# Altium project wifi-plug.PrjPcb
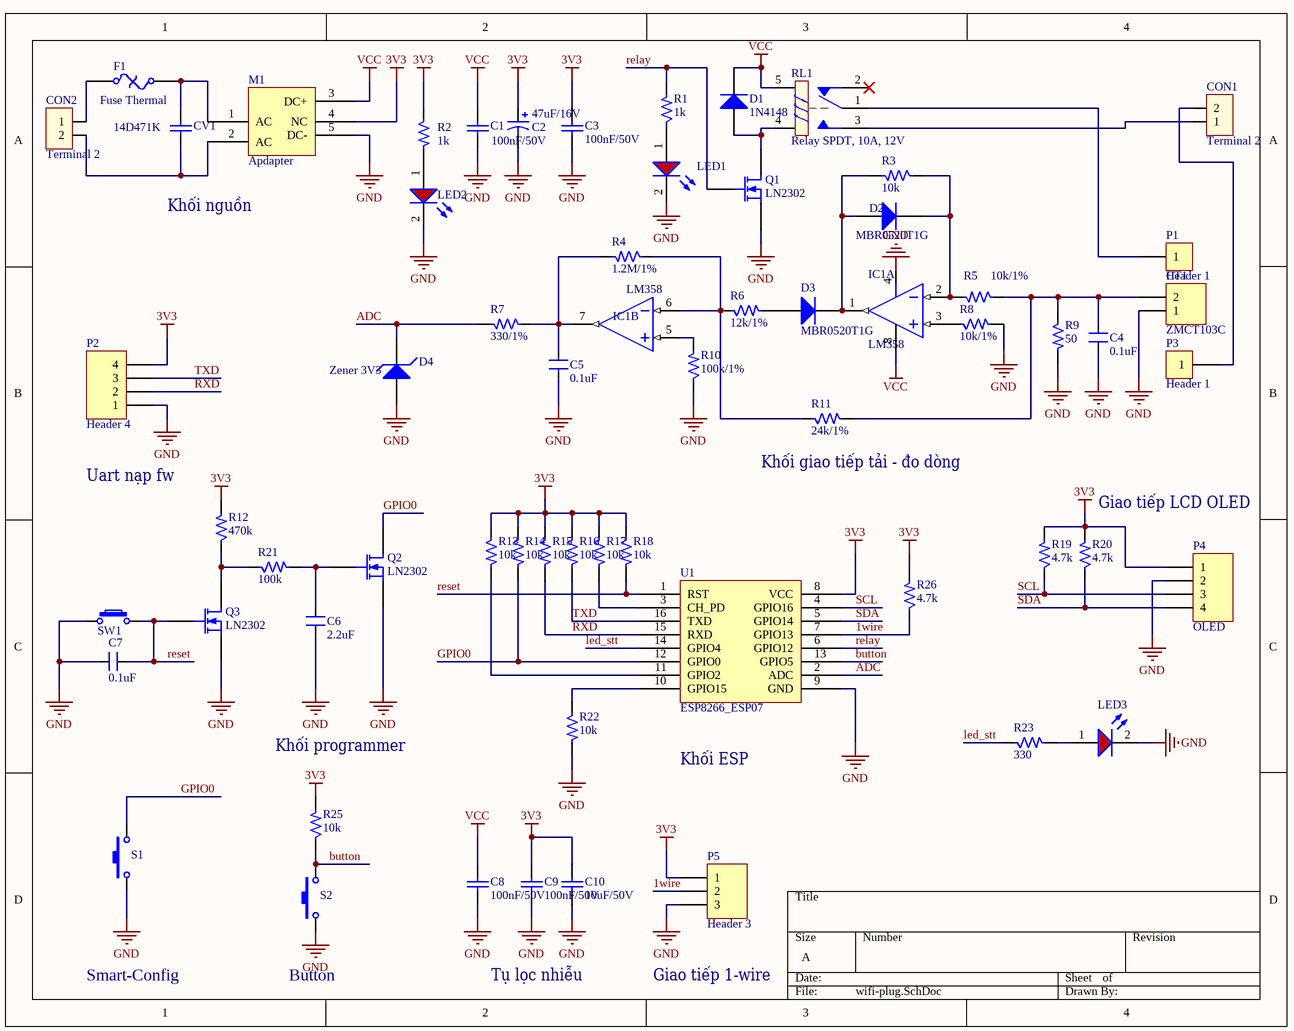
[diagram p0: wifi-plug.SchDoc]
1 sheet, 62 parts. Net scope: global (net labels, ports and power ports of the same name join across sheets).
Board files: wifi-plug.PcbDoc, wifi-plu-panel.PcbDoc

## Sheet wifi-plug.SchDoc
size A

### Parts
C1  100nF/50V  [C0805]
C2  47uF/16V  [C2312]
C3  100nF/50V  [C0805]
C4  0.1uF  [C0805]
C5  0.1uF  [C0805]
C6  2.2uF  [C0805]
C7  0.1uF  [C0805]
C8  100nF/50V  [C0805]
C9  100nF/50V  [C0805]
C10  10uF/50V  [C1206]
CON1  Terminal 2  [domino-2pin-7.62]
CON2  Terminal 2  [domino-2pin-7.62]
CT1  ZMCT103C  [ZMCT103C]
CV1  value 14D471K  [C_Ceramic_KV]  (hidden comment: Cap1)
D1  1N4148  [DO-214AC (SMA)]
D2  MBR0520T1G  [SOD-123 W]
D3  MBR0520T1G  [SOD-123 W]
D4  Zener 3V3  [SOD-123]
F1  Fuse Thermal  [PTC1812]
IC1  LM358  [SOIC8]  (parts A,B of 2)
LED1  150080RS75000  [led-3mm]  (value not drawn)
LED2  150080RS75000  [LED_0805_Red]  (value not drawn)
LED3  150080RS75000  [led-3mm]  (value not drawn)
M1  Apdapter  [Module-Supply]
P1  Header 1  [PAD 1]
P2  Header 4  [HDR1X4H]
P3  Header 1  [PAD 1]
P4  OLED  [HDR1X4 - FEMALE]
P5  Header 3  [HDR1X3]
Q1  LN2302  [SOT23-3]
Q2  LN2302  [SOT23-3]
Q3  LN2302  [SOT23-3]
R1  1k  [R0805]
R2  1k  [R0805]
R3  10k  [R0805]
R4  1.2M/1%  [R0805]
R5  10k/1%  [R0805]
R6  12k/1%  [R0805]
R7  330/1%  [R0805]
R8  10k/1%  [R0805]
R9  50  [R0805]
R10  100k/1%  [R0805]
R11  24k/1%  [R0805]
R12  470k  [R0805]
R13  10k  [R0805]
R14  10k  [R0805]
R15  10k  [R0805]
R16  10k  [R0805]
R17  10k  [R0805]
R18  10k  [R0805]
R19  4.7k  [R0805]
R20  4.7k  [R0805]
R21  100k  [R0805]
R22  10k  [R0805]
R23  330  [R0805]
R25  10k  [R0805]
R26  4.7k  [R0805]
RL1  Relay SPDT, 10A, 12V  [RL_SPDT_10A]
S1  SW-SMD  [Button Tactile Switch]  (value not drawn)
S2  SW-SMD  [Button Tactile Switch]  (value not drawn)
SW1  SW2  [SMD(2)]  (value not drawn)
U1  ESP8266_ESP07  [ESP_12]

### Nets
3V3: C2.1 C3.1 C9.1 C10.1 M1.4(NC) P2.4 P4.1 P5.1 R2.1 R12.2 R13.1 R14.1 R15.1 R16.1 R17.1 R18.1 R19.2 R20.2 R25.2 R26.2 U1.8(VCC)
GND: C1.2 C2.2 C3.2 C4.1 C5.1 C6.1 C7.1 C8.2 C9.2 C10.2 CT1.1 D4.2(A) IC1.4(-V) LED1.2(C) LED2.2(C) LED3.2(C) M1.5(DC-) P2.1 P4.2 P5.3 Q1.2(S) Q2.2(S) Q3.2(S) R8.2 R9.2 R10.1 R22.2 S1.1 S2.1 SW1.1 U1.9(GND)
VCC: C1.1 C8.1 D1.2(K) IC1.8(+V) M1.3(DC+) RL1.5
1wire: P5.2 R26.1 U1.7(GPIO13)
ADC: D4.1(K) R7.2 U1.2(ADC)
button: R25.1 S2.2 U1.13(GPIO5)
GPIO0: Q2.3(D) R14.2 S1.2 U1.12(GPIO0)
led_stt: R23.1 U1.14(GPIO4)
relay: Q1.1(G) R1.2 U1.6(GPIO12)
reset: C7.2 Q3.1(G) R18.2 SW1.2 U1.1(RST)
RXD: P2.2 R15.2 U1.15(RXD)
SCL: P4.3 R19.1 U1.4(GPIO16)
SDA: P4.4 R20.1 U1.5(GPIO14)
TXD: P2.3 R16.2 U1.16(TXD)
NetC4_2: C4.2 CT1.2 R5.1 R9.1 R11.2
NetC5_2: C5.2 IC1.7(OUT) R4.2 R7.1
NetC6_2: C6.2 Q2.1(G) R21.2
NetCON1_1: CON1.1 RL1.3
NetCON1_2: CON1.2 P3.1
NetCON2_1: CON2.1 F1.1
NetCON2_2: CON2.2 CV1.1 M1.2(AC)
NetCV1_2: CV1.2 F1.2 M1.1(AC)
NetD1_1: D1.1(A) Q1.3(D) RL1.4
NetD2_1: D2.1(A) D3.2(K) IC1.1(OUT) R3.2
NetD2_2: D2.2(K) IC1.2(IN-) R3.1 R5.2
NetD3_1: D3.1(A) R6.2
NetIC1_3: IC1.3(IN+) R8.1
NetIC1_5: IC1.5(IN+) R10.2
NetIC1_6: IC1.6(IN-) R4.1 R6.1 R11.1
NetLED1_1: LED1.1(A) R1.1
NetLED2_1: LED2.1(A) R2.2
NetLED3_1: LED3.1(A) R23.2
NetP1_1: P1.1 RL1.1
NetQ3_3: Q3.3(D) R12.1 R21.1
NetR13_2: R13.2 U1.11(GPIO2)
NetR17_2: R17.2 U1.3(CH_PD)
NetR22_1: R22.1 U1.10(GPIO15)

Not connected (* = marked no-connect by the designer): RL1 2*

### Notes on the sheet
- Khối nguồn
- Uart nạp fw
- (near R11) Khối giao tiếp tải - đo dòng
- (near R20) Giao tiếp LCD OLED
- Khối programmer
- Khối ESP
- Smart-Config
- (near S2) Button
- Tụ lọc nhiễu
- Giao tiếp 1-wire

### Library data of the parts
C1 C3 C8-C10 = Cap Semi: Capacitor 100n 16V 0603; Published: 8-Jun-2000; LatestRevisionDate: 29-May-2009; LatestRevisionNote: IPC-7351 Footprint Added.; PackageReference: C1206; Publisher: Altium Limited; PackageDescription: Chip Capacitor
C2 = Cap Pol3: Polarized Capacitor (Surface Mount); Published: 8-Jun-2000; LatestRevisionDate: 29-May-2009; LatestRevisionNote: IPC-7351 Footprint Added.; PackageReference: C0805; Publisher: Altium Limited; PackageDescription: Chip Capacitor; Supplier 1: Newark; Supplier Part Number 1: 31T8184
C4-C7 = CM Ceramic: SMD Ceramic  Capacitor; Manufacturer No: C0805KRX7R9BB104; Manufacturer: Yageo; Voltage: 50V; Tolerance: 10%; Specification: ="Capacitance"+" "+"Voltage"+" " +"Tolerance"
  C4 C5 C7: Capacitance: 0.1uF
  C6: Capacitance: 2.2uF
CON1 CON2 = Terminal 2: Value: Connector 2
CT1 = Header 2: Header, 2-Pin; LatestRevisionDate: 17-Jul-2002; LatestRevisionNote: Re-released for DXP Platform.; Publisher: Altium Limited
CV1 = Cap1: Polar Capacitor; Published: 8-Jun-2000; LatestRevisionDate: 17-Jul-2002; LatestRevisionNote: Re-released for DXP Platform.; PackageReference: RAD-0.3; Publisher: Altium Limited; PackageDescription: Radial Cap, Thru-Hole; 2 Leads; 0.3 in Pin Spacing
D1-D3 = Diode Normal: Published: 8-Jun-2000; LatestRevisionDate: 17-Jul-2002; LatestRevisionNote: Re-released for DXP Platform.; DatasheetDocument: 1997; PackageReference: DO-35; Publisher: Altium Limited; Code_JEDEC: DO-204-AH; ComponentLink1Description: Manufacturer Link; ComponentLink1URL: http://www.fairchildsemi.com/; ComponentLink2Description: Datasheet; ComponentLink2URL: http://www.fairchildsemi.com/ds/1N%2F1N4448.pdf
D4 = Diode Zener: Zener Voltage Regulators; Manufacturer No: MMSZ5222BT1G; Manufacturer: ON Semiconductor; Specification: 500 mW SOD−123 Surface Mount
F1 = Fuse Thermal: Thermal Fuse; Published: 24-Mar-1999; LatestRevisionDate: 17-Jul-2002; LatestRevisionNote: Re-released for DXP Platform.; PackageReference: PIN-W2/E2.8; Publisher: Altium Limited
IC1 = LM358: Low-Power Dual Operational Amplifier; Value: LM358
LED1-LED3 = led-0805: SMD mono-color Chip LED, WL-SMCW, Red; Manufacturer: W黵th Elektronik eiSos GmbH; PartNo: 150080RS75000; ComponentLink1Description: Manufacturer; ComponentLink1URL: http://www.we-online.de; Created by: Christin Otto; Created Date: June 2013; ComponentLink2Description: Datasheet; ComponentLink2URL: http://katalog.we-online.com/led/datasheet/150080RS75000.pdf; Color: Red
M1 = Module_Supply
P1 P3 = Header 1: Header, 1-Pin; LatestRevisionDate: 17-Jul-2002; LatestRevisionNote: Re-released for DXP Platform.; Publisher: Altium Limited
P2 P4 = Header 4: Header, 4-Pin; LatestRevisionDate: 17-Jul-2002; LatestRevisionNote: Re-released for DXP Platform.; Publisher: Altium Limited
P5 = Header 3: Header, 3-Pin; LatestRevisionDate: 17-Jul-2002; LatestRevisionNote: Re-released for DXP Platform.; Publisher: Altium Limited
Q1-Q3 = MOSFET-N: N-Channel MOSFET; Published: 8-Jun-2000; LatestRevisionDate: 17-Jul-2002; LatestRevisionNote: Re-released for DXP Platform.; PackageVersion: 1995/1996; PackageReference: E3; Publisher: Altium Limited; PackageDescription: TO, Flat Index; 3 In-Line, Axial Leads; Body Dia. 4.6mm; Lead Dia. 0.5 mm (max)
R1-R23 R25 R26 = RM: Resistor SMD; Manufacturer No: RM10JTN102; Manufacturer: UniOhm; Power Rating: 1/10W; Specification: ="Value" + "  "+ "Power Rating"
  R1 R2: Value: 1k
  R3 R13-R18 R22 R25: Value: 10k
  R4: Value: 1.2M/1%
  R5 R8: Value: 10k/1%
  R6: Value: 12k/1%
  R7: Value: 330/1%
  R9: Value: 50
  R10: Value: 100k/1%
  R11: Value: 24k/1%
  R12: Value: 470k
  R19 R20 R26: Value: 4.7k
  R21: Value: 100k
  R23: Value: 330
RL1 = Relay 1: Relay SPDT,10A - 12VDC 5 Pin; Value: Relay SPDT, 10A, 12V
S1 S2 = SW-SMD: Switch; Published: 24-Mar-1999; LatestRevisionDate: 17-Jul-2002; LatestRevisionNote: Re-released for DXP Platform.; PackageReference: SPST-2; Publisher: Altium Limited